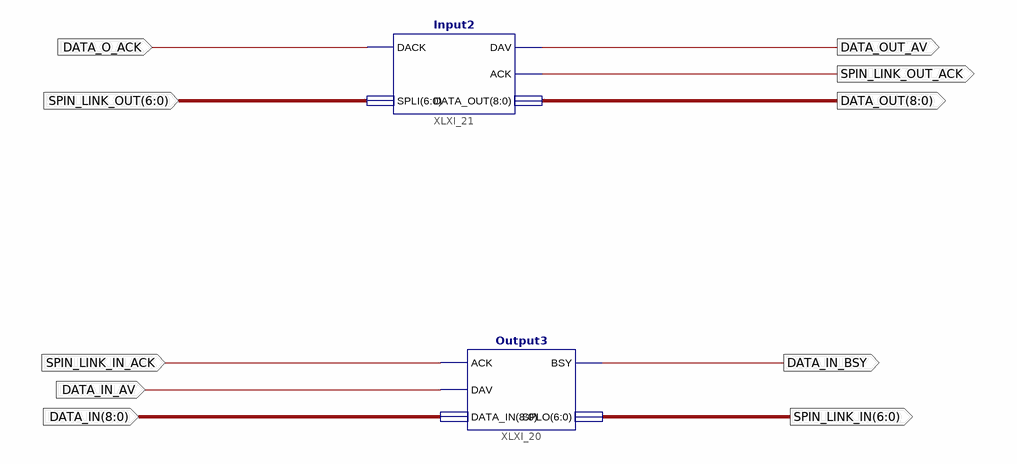
[diagram p0: schematic sheet 1]
// Xilinx ISE schematic main.sch (xbr) as structural Verilog: 2 symbols, 10 ports
module main (
  input  DATA_O_ACK,
  input  [6:0] SPIN_LINK_OUT,
  input  DATA_IN_AV,
  input  [8:0] DATA_IN,
  input  SPIN_LINK_IN_ACK,
  output [8:0] DATA_OUT,
  output DATA_OUT_AV,
  output SPIN_LINK_OUT_ACK,
  output DATA_IN_BSY,
  output [6:0] SPIN_LINK_IN
);

  Output3 XLXI_20 (.ACK(SPIN_LINK_IN_ACK), .DAV(DATA_IN_AV), .DATA_IN(DATA_IN), .BSY(DATA_IN_BSY), .SPLO(SPIN_LINK_IN));
  Input2 XLXI_21 (
    .DACK(DATA_O_ACK), .SPLI(SPIN_LINK_OUT), .DAV(DATA_OUT_AV), .ACK(SPIN_LINK_OUT_ACK), .DATA_OUT(DATA_OUT));
endmodule
